# Altium schematic sheet Bidirectional Voltage Translator.SchDoc: 3V3 - 1V8 Voltage Level Translator
size A3; SheetNumber: 26; SheetTotal: 37
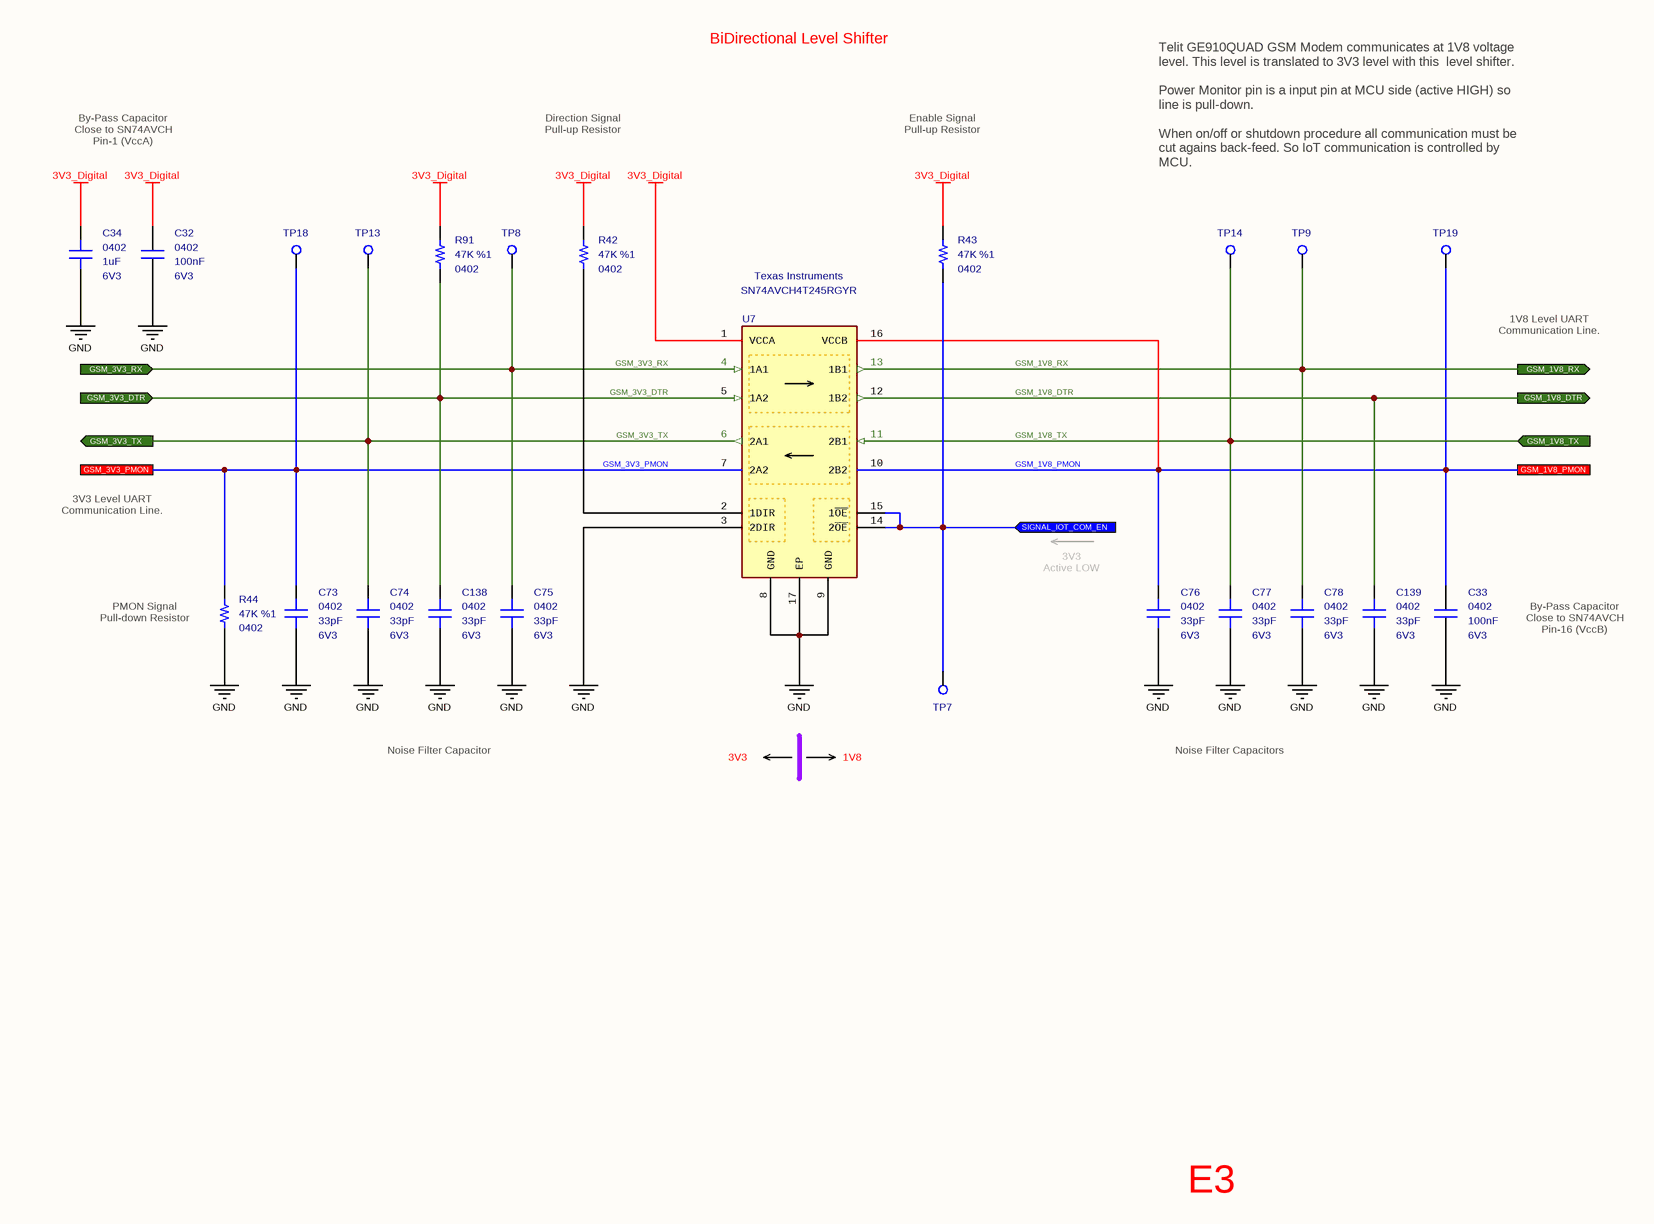
[diagram p0: Bidirectional Voltage Translator.SchDoc]

## Parts
C32  value 100nF  Case: 0402  Voltage: 6V3  [CAPACITOR_0402]  (hidden comment: Multilayer Ceramic Capacitor)
C33  value 100nF  Case: 0402  Voltage: 6V3  [CAPACITOR_0402]  (hidden comment: Multilayer Ceramic Capacitor)
C34  value 1uF  Case: 0402  Voltage: 6V3  [CAPACITOR_0402]  (hidden comment: Multilayer Ceramic Capacitor)
C73  value 33pF  Case: 0402  Voltage: 6V3  [CAPACITOR_0402]  (hidden comment: Multilayer Ceramic Capacitor)
C74  value 33pF  Case: 0402  Voltage: 6V3  [CAPACITOR_0402]  (hidden comment: Multilayer Ceramic Capacitor)
C75  value 33pF  Case: 0402  Voltage: 6V3  [CAPACITOR_0402]  (hidden comment: Multilayer Ceramic Capacitor)
C76  value 33pF  Case: 0402  Voltage: 6V3  [CAPACITOR_0402]  (hidden comment: Multilayer Ceramic Capacitor)
C77  value 33pF  Case: 0402  Voltage: 6V3  [CAPACITOR_0402]  (hidden comment: Multilayer Ceramic Capacitor)
C78  value 33pF  Case: 0402  Voltage: 6V3  [CAPACITOR_0402]  (hidden comment: Multilayer Ceramic Capacitor)
C138  value 33pF  Case: 0402  Voltage: 6V3  [CAPACITOR_0402]  (hidden comment: Multilayer Ceramic Capacitor)
C139  value 33pF  Case: 0402  Voltage: 6V3  [CAPACITOR_0402]  (hidden comment: Multilayer Ceramic Capacitor)
R42  value 47K  Tolerance: %1  Case: 0402  [RESISTOR_0402]  (hidden comment: Thick Film Resistor)
R43  value 47K  Tolerance: %1  Case: 0402  [RESISTOR_0402]  (hidden comment: Thick Film Resistor)
R44  value 47K  Tolerance: %1  Case: 0402  [RESISTOR_0402]  (hidden comment: Thick Film Resistor)
R91  value 47K  Tolerance: %1  Case: 0402  [RESISTOR_0402]  (hidden comment: Thick Film Resistor)
TP7  PCB - Test Point  [Test_Pad - Hole]  (value not drawn)  (no BOM)
TP8  PCB - Test Point  [Test_Pad - Hole]  (value not drawn)  (no BOM)
TP9  PCB - Test Point  [Test_Pad - Hole]  (value not drawn)  (no BOM)
TP13  PCB - Test Point  [Test_Pad - Hole]  (value not drawn)  (no BOM)
TP14  PCB - Test Point  [Test_Pad - Hole]  (value not drawn)  (no BOM)
TP18  PCB - Test Point  [Test_Pad - Hole]  (value not drawn)  (no BOM)
TP19  PCB - Test Point  [Test_Pad - Hole]  (value not drawn)  (no BOM)
U7  Manufacturer_Name: Texas Instruments  Manufacturer_Part_Number: SN74AVCH4T245RGYR  [VQFN16]  (hidden comment: Voltage Level Shifter)

## Ports
GSM_1V8_DTR (out), GSM_1V8_PMON, GSM_1V8_RX (out), GSM_1V8_TX (in), GSM_3V3_DTR (in), GSM_3V3_PMON, GSM_3V3_RX (in), GSM_3V3_TX (out), SIGNAL_IOT_COM_EN (in)

## Nets
3V3_Digital: C32.2 C34.2 R42.2 R43.2 R91.2 U7.1(VCCA)
GND: C32.1 C33.1 C34.1 C73.1 C74.1 C75.1 C76.1 C77.1 C78.1 C138.1 C139.1 R44.1 U7.3(2DIR) U7.8(GND) U7.9(GND) U7.17(EP)
GSM_1V8_DTR: C139.2 U7.12(1B2) ; port GSM_1V8_DTR
GSM_1V8_PMON: C33.2 C76.2 TP19.1 U7.10(2B2) U7.16(VCCB) ; port GSM_1V8_PMON
GSM_1V8_RX: C78.2 TP9.1 U7.13(1B1) ; port GSM_1V8_RX
GSM_1V8_TX: C77.2 TP14.1 U7.11(2B1) ; port GSM_1V8_TX
GSM_3V3_DTR: C138.2 R91.1 U7.5(1A2) ; port GSM_3V3_DTR
GSM_3V3_PMON: C73.2 R44.2 TP18.1 U7.7(2A2) ; port GSM_3V3_PMON
GSM_3V3_RX: C75.2 TP8.1 U7.4(1A1) ; port GSM_3V3_RX
GSM_3V3_TX: C74.2 TP13.1 U7.6(2A1) ; port GSM_3V3_TX
SIGNAL_IOT_COM_EN: R43.1 TP7.1 U7.14(2~{OE}) U7.15(1~{OE}) ; port SIGNAL_IOT_COM_EN
NetR42_1: R42.1 U7.2(1DIR)

## Notes on the sheet
- BiDirectional Level Shifter
- By-Pass Capacitor
  Close to SN74AVCH
  Pin-1 (VccA)
- Direction Signal
  Pull-up Resistor
- Enable Signal
  Pull-up Resistor
- Telit GE910QUAD GSM Modem communicates at 1V8 voltage level. This level is translated to 3V3 level with this  level shifter.
  Power Monitor pin is a input pin at MCU side (active HIGH) so line is pull-down.
  When on/off or shutdown procedure all communication must be cut agains back-feed. So IoT communication is controlled by MCU.
- 1V8 Level UART Communication Line.
- 3V3 Level UART Communication Line.
- (near C76) 3V3
  Active LOW
- (near R44) PMON Signal
  Pull-down Resistor
- By-Pass Capacitor
  Close to SN74AVCH
  Pin-16 (VccB)
- Noise Filter Capacitor
- 3V3
- 1V8
- Noise Filter Capacitors
- E3
- Title
- Size:
- Date:
- A3
- Number:
- Time:
- Revision:
- Sheet
- of
- File:

## Library data of the parts
C32 C33 = Capacitor - 100nF [0402-6V3]: Capacitor - 100nF [0402-6V3] (Ceramic); Manufacturer_Name: AVX; Manufacturer_Part_Number: 04026D104KAT4A; Dielectric: X5R; Tolerance: %10; Height: 0.25mm; Mouser_Part_Number: 581-04026D104KAT4A; ComponentLink1Description: Mouser; ComponentLink1URL: https://www.mouser.com.tr/ProductDetail/AVX/04026D104KAT4A?qs=sGAEpiMZZMs0AnBnWHyRQPg4iYkCw7IMED%2F4kpqgf7w%3D; ComponentLink2Description: DataSheet; ComponentLink2URL: https://www.mouser.com.tr/datasheet/2/40/cx5r-776519.pdf; ROHS: Yes; Maximum Operating Temperature: +85; Minimum Operating Temperature: -55; Supplier 1: Avnet; Supplier Part Number 1: 04026D104KAT4A
C34 = Capacitor - 1uF [0402-6V3): Capacitor - 1uF [0402] (Ceramic); Manufacturer_Name: Murata Electronics; Manufacturer_Part_Number: GRM153R60J105ME95D; Dielectric: X5R; Tolerance: 20%; Height: 0.3mm; Mouser_Part_Number: 81-GRM153R60J105ME5D; Maximum Operating Temperature: +85; Minimum Operating Temperature: -55; RoHS: Yes; Weight: 6mg; ComponentLink1Description: DataSheet; ComponentLink1URL: https://psearch.en.murata.com/capacitor/product/GRM153R60J105ME95%23.html; ComponentLink2Description: Mouser; ComponentLink2URL: https://www.mouser.com/Search/Refine.aspx?Keyword=81-GRM153R60J105ME5D; Supplier 1: Future Electronics; Supplier 2: Future Electronics; Supplier 3: Mouser; Supplier 4: Arrow; Supplier 5: Digi-Key; Supplier Part Number 5: 490-14576-1-ND; Supplier Part Number 4: GRM153R60J105ME95D; Supplier Part Number 3: 81-GRM153R60J105ME5D; Supplier Part Number 2: GRM153R60J105ME95D-REEL; Supplier Part Number 1: GRM153R60J105ME95D-CUTT
C73-C78 C138 C139 = Capacitor - 33pF [0402-6V3]: Capacitor - 33pF [0402] (Ceramic); Manufacturer_Name: Kemet; Manufacturer_Part_Number: C0402C330J9RACAUTO; Dielectric: X7R; Tolerance: 10%; Height: 0.5mm; Mouser_Part_Number: 80-C0402C330J9RAUTO; Maximum Operating Temperature: +125; Minimum Operating Temperature: -55; ROHS: Yes; ComponentLink1Description: DataSheet; ComponentLink1URL: https://api.kemet.com/component-edge/download/datasheet/C0402C330J9RACAUTO.pdf; ComponentLink2Description: Mouser; ComponentLink2URL: https://www.mouser.com/Search/Refine.aspx?Keyword=80-C0402C330J9RAUTO; Supplier 1: Mouser; Supplier Part Number 1: 80-C0402C330J9RAUTO
R42-R44 R91 = Resistor - 47K: Thick Film Resistors - SMD 1/16 W 47 Kohms 1%; Manufacturer_Name: Vishay; Manufacturer_Part_Number: CRCW040247K0FKED; Height: 0.4mm; Mouser_Part_Number: 71-CRCW0402-47K-E3; ComponentLink1Description: DataSheet; ComponentLink1URL: https://www.mouser.com.tr/datasheet/2/427/dcrcwe3-1762152.pdf; ComponentLink2Description: Mouser; ComponentLink2URL: https://www.mouser.com.tr/ProductDetail/Vishay-Dale/CRCW040247K0FKED?qs=sGAEpiMZZMu61qfTUdNhG2DpbjADlD3GL%252B3h1elTxqU%3D; Supplier 1: Mouser; Supplier 2: Digi-Key; Supplier Part Number 1: 71-CRCW040247K0FKEDH; Supplier Part Number 2: 541-47.0KYCT-ND
TP7-TP9 TP13 TP14 TP18 TP19 = PCB - Test Point: Test Point
U7 = IC - SN74AVCH4T245: Translation - Voltage Levels Low Power Dual Channel; Supply Voltage - Max: 3.6V; Supply Voltage - Min: 1.2V; Height: 1mm; Mouser_Part_Number: 595-SN74AVCH4T245RGY; ComponentLink1Description: DataSheet; ComponentLink1URL: http://www.ti.com/general/docs/suppproductinfo.tsp?distId=26&gotoUrl=http%3A%2F%2Fwww.ti.com%2Flit%2Fgpn%2Fsn74avch4t245; Maximum Operating Temperature: +85; Minimum Operating Temperature: -40; ComponentLink2Description: Mouser; ComponentLink2URL: https://www.mouser.com.tr/ProductDetail/Texas-Instruments/SN74AVCH4T245RGYR?qs=PVVDbbWpW3IMTHF1QV2g%252BQ==; Supplier 1: Mouser; Supplier 2: Arrow; Supplier 3: Digi-Key; Supplier Part Number 1: 595-SN74AVCH4T245RGY; Supplier Part Number 2: SN74AVCH4T245RGYR; Supplier Part Number 3: 296-18262-1-ND; Case: VQFN-16